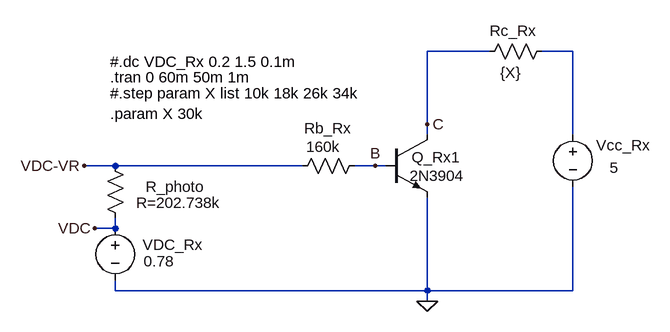
[diagram p0: schematic elec310_proj_DCRx.asc]
elec310_proj_DCRx.asc, the LTspice schematic file:
Version 4
SHEET 1 880 680
WIRE 448 -16 352 -16
WIRE 576 -16 528 -16
WIRE 352 96 352 -16
WIRE 352 112 352 96
WIRE 576 112 576 -16
WIRE -128 160 -176 160
WIRE 160 160 -128 160
WIRE 272 160 240 160
WIRE 288 160 272 160
WIRE -128 256 -128 240
WIRE -128 256 -160 256
WIRE -128 352 -128 336
WIRE 352 352 352 208
WIRE 352 352 -128 352
WIRE 576 352 576 192
WIRE 576 352 352 352
WIRE 352 368 352 352
FLAG 352 368 0
FLAG 352 96 C
FLAG -160 256 VDC
FLAG -176 160 VDC-VR
FLAG 272 160 B
SYMBOL npn 288 112 R0
WINDOW 0 40 35 Left 2
WINDOW 3 37 63 Left 2
SYMATTR InstName Q_Rx1
SYMATTR Value 2N3904
SYMBOL res 144 176 R270
WINDOW 0 58 55 VTop 2
WINDOW 3 61 48 VBottom 2
SYMATTR InstName Rb_Rx
SYMATTR Value 160k
SYMBOL voltage 576 96 R0
WINDOW 123 0 0 Left 0
WINDOW 39 0 0 Left 0
WINDOW 0 118 32 Right 2
WINDOW 3 70 67 Right 2
SYMATTR InstName Vcc_Rx
SYMATTR Value 5
SYMBOL res 544 -32 R90
WINDOW 0 0 60 VBottom 2
WINDOW 3 33 64 VTop 2
SYMATTR InstName Rc_Rx
SYMATTR Value {X}
SYMBOL res -112 256 R180
WINDOW 0 -122 64 Left 2
WINDOW 3 -147 39 Left 2
SYMATTR InstName R_photo
SYMATTR Value R=202.738k
SYMBOL voltage -128 240 R0
WINDOW 0 42 41 Left 2
WINDOW 3 44 67 Left 2
WINDOW 123 0 0 Left 0
WINDOW 39 0 0 Left 0
SYMATTR InstName VDC_Rx
SYMATTR Value 0.78
TEXT -136 24 Left 2 !.tran 0 60m 50m 1m
TEXT -136 48 Left 2 !#.step param X list 10k 18k 26k 34k
TEXT -136 0 Left 2 !#.dc VDC_Rx 0.2 1.5 0.1m
TEXT -136 80 Left 2 !.param X 30k

The netlist it stands for:
* elec310_proj_DCRx.asc
Q_Rx1 C B 0 0 2N3904
Rb_Rx VDC-VR B 160k
Vcc_Rx N001 0 5
Rc_Rx N001 C {X}
R_photo VDC VDC-VR R=202.738k
VDC_Rx VDC 0 0.78
.model NPN NPN
.model PNP PNP
.lib standard.bjt
.tran 0 60m 50m 1m
#.step param X list 10k 18k 26k 34k
#.dc VDC_Rx 0.2 1.5 0.1m
.param X 30k
.backanno
.end